# Altium schematic sheet TESTSensorBoard.SchDoc
size A
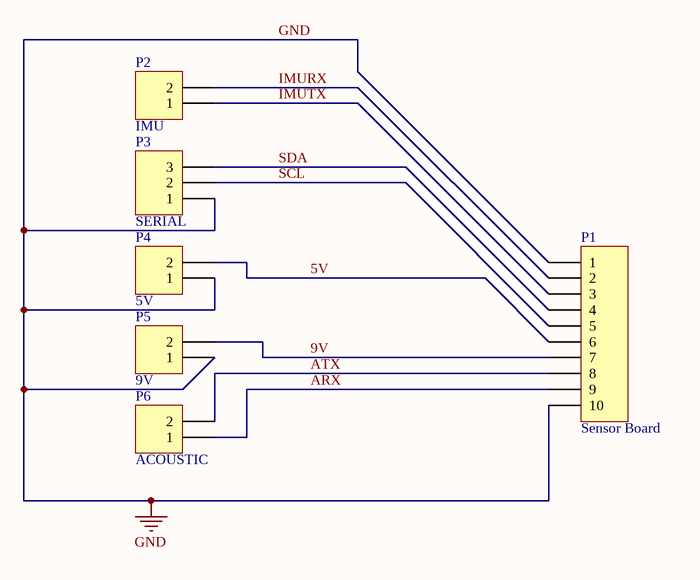
[diagram p0: TESTSensorBoard.SchDoc]

## Parts
P1  Sensor Board  [ICV 2,5/10-G-5,08]
P2  IMU  [HDR1X2]
P3  SERIAL  [HDR1X3]
P4  5V  [HDR1X2]
P5  9V  [HDR1X2]
P6  ACOUSTIC  [HDR1X2]

## Nets
GND: P1.1 P1.10 P3.1 P4.1 P5.1
5V: P1.6 P4.2
9V: P1.7 P5.2
ARX: P1.9 P6.1
ATX: P1.8 P6.2
IMURX: P1.2 P2.2
IMUTX: P1.3 P2.1
SCL: P1.5 P3.2
SDA: P1.4 P3.3

## Library data of the parts
P1 = ICV 2,5/10-G-5,08: Header, 10-Pin; Manufacturer 1: PHOENIX CONTACT; Description 1: PHOENIX CONTACT - ICV 2,5/10-G-5,08 - TERMINAL BLOCK, SOCKET, 10POS, TH; Supplier 1: Newark; Supplier Part Number 1: 69R9559; RoHS: YES; Stock 1: 50; Pricing 1: 1=9.77, 10=9.51, 25=9.26, 50=8.89, 100=8.17, 250=7.55, 500=7.2, 1000=6.4 (USD); ComponentLink1URL: http://www.farnell.com/datasheets/528338.pdf; ComponentLink1Description: http://www.farnell.com/datasheets/528338.pdf
P2 P4-P6 = Header 2: Header, 2-Pin; LatestRevisionDate: 17-Jul-2002; LatestRevisionNote: Re-released for DXP Platform.; Publisher: Altium Limited
P3 = Header 3: Header, 3-Pin; LatestRevisionDate: 17-Jul-2002; LatestRevisionNote: Re-released for DXP Platform.; Publisher: Altium Limited